# Altium project WS7.820.291.V04.PrjPCB
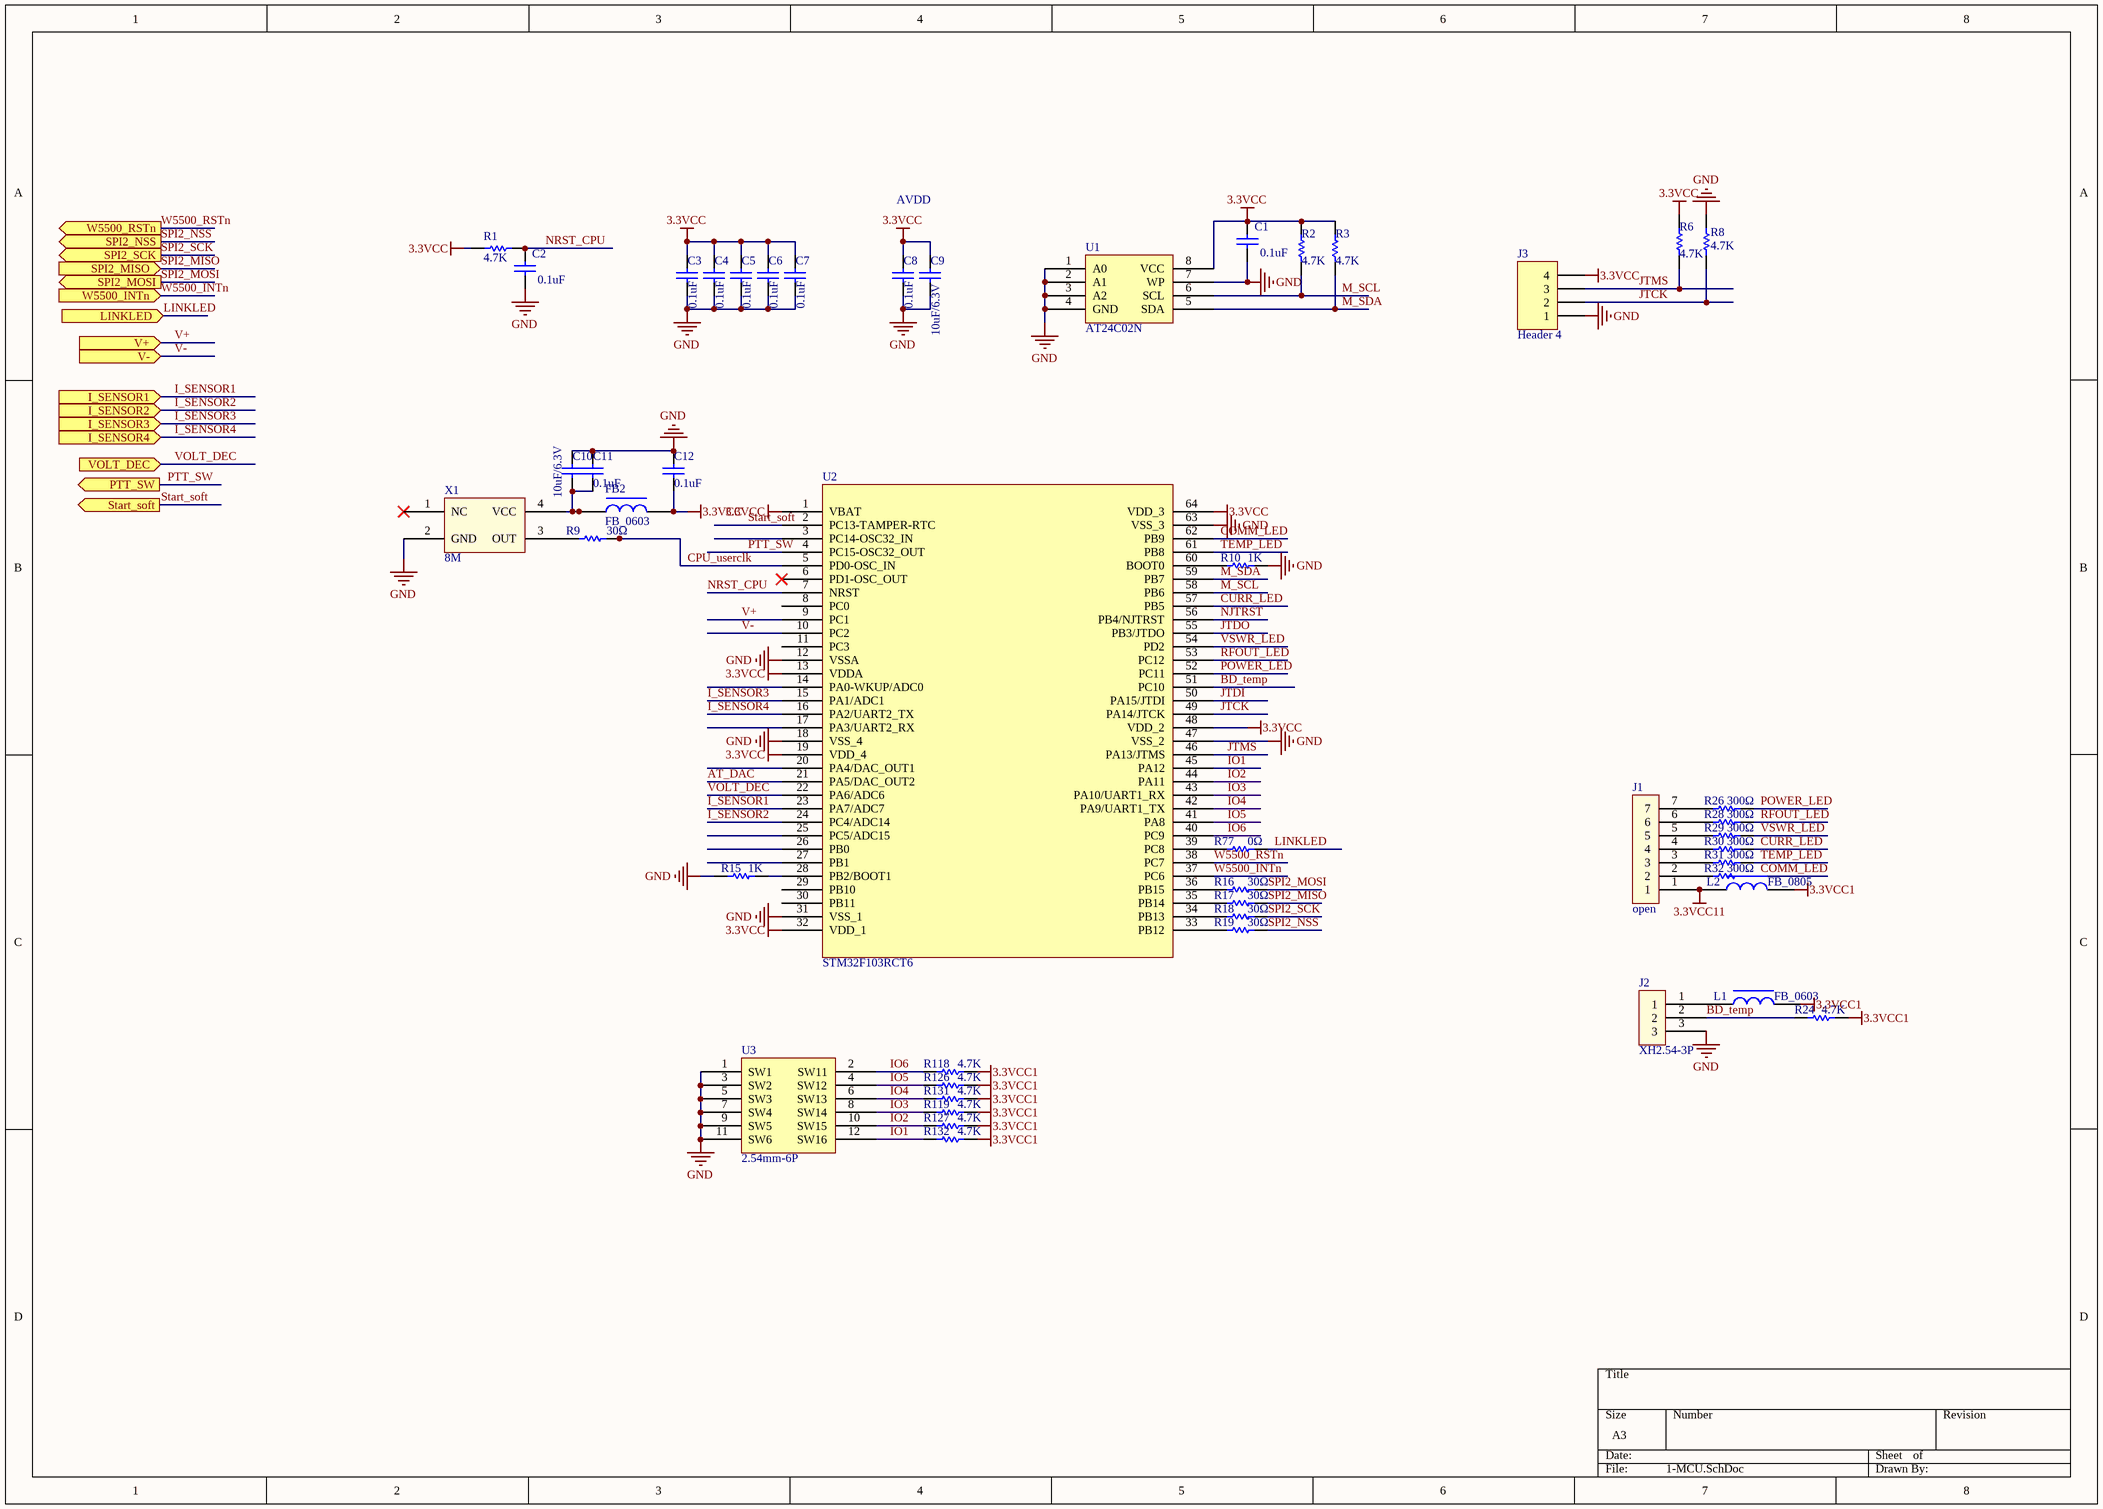
[diagram p0: 1-MCU.SchDoc]
4 sheets, 240 parts. Net scope: flat (ports and power ports of the same name join across sheets).
Board file: WS7.820.291.V04.PcbDoc
Sheets:
  1-MCU.SchDoc
  2-RJ45.SchDoc
  3-RF.SchDoc
  4-POWER.SchDoc

## Sheet 1-MCU.SchDoc
size A3

### Parts
C1  0.1uF  [C0603]
C2  0.1uF  [C0603]
C3  0.1uF  [C0603]
C4  0.1uF  [C0603]
C5  0.1uF  [C0603]
C6  0.1uF  [C0603]
C7  0.1uF  [C0603]
C8  0.1uF  [C0603]
C9  10uF/6.3V  [C0603]
C10  10uF/6.3V  [C0603]
C11  0.1uF  [C0603]
C12  0.1uF  [C0603]
FB2  FB_0603  [L0603]
J1  open  [KF2510-7P -2R54-17R8x6R0-wanzhen]
J2  XH2.54-3P  [XH2.54mm-10R0x7R0--zhizhen]
J3  Header 4  [HDR1X4]
L1  FB_0603  [L0603]
L2  FB_0805  [L0805]
R1  4.7K  [R0603]
R2  4.7K  [R0603]
R3  4.7K  [R0603]
R6  4.7K  [R0603]
R8  4.7K  [R0603]
R9  30Ω  [R0603]
R10  1K  [R0603]
R15  1K  [R0603]
R16  30Ω  [R0603]
R17  30Ω  [R0603]
R18  30Ω  [R0603]
R19  30Ω  [R0603]
R24  4.7K  [R0603]
R26  300Ω  [R0603]
R28  300Ω  [R0603]
R29  300Ω  [R0603]
R30  300Ω  [R0603]
R31  300Ω  [R0603]
R32  300Ω  [R0603]
R77  0Ω  [R0603]
R118  4.7K  [R0603]
R119  4.7K  [R0603]
R126  4.7K  [R0603]
R127  4.7K  [R0603]
R131  4.7K  [R0603]
R132  4.7K  [R0603]
U1  AT24C02N  [SOIC8_1R27_3R9x4R9]
U2  STM32F103RCT6  [LQFP64-0R50-10x10]
U3  2.54mm-6P  [con12TM-2R54-2X6-boma]
X1  8M  [CRY4SM-5R0x7R0]

### Ports
I_SENSOR1 (in), I_SENSOR2 (in), I_SENSOR3 (in), I_SENSOR4 (in), LINKLED (in), PTT_SW (out), SPI2_MISO (in), SPI2_MOSI (out), SPI2_NSS (out), SPI2_SCK (out), Start_soft (out), V+ (in), V- (in), VOLT_DEC (in), W5500_INTn (in), W5500_RSTn (out)

### Nets
3.3VCC: C1.2 C3.2 C4.2 C5.2 C6.2 C7.2 C8.2 C9.2 C12.1 FB2.2 J3.4 R1.2 R2.2 R3.2 R6.2 U1.8(VCC) U2.1(VBAT) U2.13(VDDA) U2.19(VDD_4) U2.32(VDD_1) U2.48(VDD_2) U2.64(VDD_3)
3.3VCC1: L1.2 L2.2 R24.1 R118.2 R119.2 R126.2 R127.2 R131.2 R132.2
3.3VCC11: J1.1 L2.1
GND: C1.1 C2.1 C3.1 C4.1 C5.1 C6.1 C7.1 C8.1 C9.1 C10.1 C11.2 C12.2 J2.3 J3.1 R8.1 R10.1 R15.1 U1.1(A0) U1.2(A1) U1.3(A2) U1.4(GND) U1.7(WP) U2.12(VSSA) U2.18(VSS_4) U2.31(VSS_1) U2.47(VSS_2) U2.63(VSS_3) U3.1(SW1) U3.3(SW2) U3.5(SW3) U3.7(SW4) U3.9(SW5) U3.11(SW6) X1.2(GND)
AT_DAC: U2.21(PA5/DAC_OUT2)
BD_temp: J2.2 R24.2 U2.51(PC10)
COMM_LED: R32.2 U2.62(PB9)
CPU_userclk: R9.2 U2.5(PD0-OSC_IN)
CURR_LED: R30.2 U2.57(PB5)
I_SENSOR1: U2.23(PA7/ADC7) ; port I_SENSOR1
I_SENSOR2: U2.24(PC4/ADC14) ; port I_SENSOR2
I_SENSOR3: U2.15(PA1/ADC1) ; port I_SENSOR3
I_SENSOR4: U2.16(PA2/UART2_TX) ; port I_SENSOR4
IO1: R132.1 U2.45(PA12) U3.12(SW16)
IO2: R127.1 U2.44(PA11) U3.10(SW15)
IO3: R119.1 U2.43(PA10/UART1_RX) U3.8(SW14)
IO4: R131.1 U2.42(PA9/UART1_TX) U3.6(SW13)
IO5: R126.1 U2.41(PA8) U3.4(SW12)
IO6: R118.1 U2.40(PC9) U3.2(SW11)
JTCK: J3.2 R8.2 U2.49(PA14/JTCK)
JTDI: U2.50(PA15/JTDI)
JTDO: U2.55(PB3/JTDO)
JTMS: J3.3 R6.1 U2.46(PA13/JTMS)
LINKLED: R77.2 ; port LINKLED
M_SCL: R2.1 U1.6(SCL) U2.58(PB6)
M_SDA: R3.1 U1.5(SDA) U2.59(PB7)
NJTRST: U2.56(PB4/NJTRST)
NRST_CPU: C2.2 R1.1 U2.7(NRST)
POWER_LED: R26.2 U2.52(PC11)
PTT_SW: U2.4(PC15-OSC32_OUT) ; port PTT_SW
RFOUT_LED: R28.2 U2.53(PC12)
SPI2_MISO: R17.2 ; port SPI2_MISO
SPI2_MOSI: R16.2 ; port SPI2_MOSI
SPI2_NSS: R19.2 ; port SPI2_NSS
SPI2_SCK: R18.2 ; port SPI2_SCK
Start_soft: U2.2(PC13-TAMPER-RTC) ; port Start_soft
TEMP_LED: R31.2 U2.61(PB8)
V+: U2.9(PC1) ; port V+
V-: U2.10(PC2) ; port V-
VOLT_DEC: U2.22(PA6/ADC6) ; port VOLT_DEC
VSWR_LED: R29.2 U2.54(PD2)
W5500_INTn: U2.37(PC6) ; port W5500_INTn
W5500_RSTn: U2.38(PC7) ; port W5500_RSTn
NetC10_2: C10.2 C11.1 FB2.1 X1.4(VCC)
NetJ1_2: J1.2 R32.1
NetJ1_3: J1.3 R31.1
NetJ1_4: J1.4 R30.1
NetJ1_5: J1.5 R29.1
NetJ1_6: J1.6 R28.1
NetJ1_7: J1.7 R26.1
NetJ2_1: J2.1 L1.1
NetR9_1: R9.1 X1.3(OUT)
NetR10_2: R10.2 U2.60(BOOT0)
NetR15_2: R15.2 U2.28(PB2/BOOT1)
NetR16_1: R16.1 U2.36(PB15)
NetR17_1: R17.1 U2.35(PB14)
NetR18_1: R18.1 U2.34(PB13)
NetR19_1: R19.1 U2.33(PB12)
NetR77_1: R77.1 U2.39(PC8)

Not connected (* = marked no-connect by the designer): U2 3(PC14-OSC32_IN) 6(PD1-OSC_OUT)* 8(PC0) 11(PC3) 14(PA0-WKUP/ADC0) 17(PA3/UART2_RX) 20(PA4/DAC_OUT1) 25(PC5/ADC15) 26(PB0) 27(PB1) 29(PB10) 30(PB11); X1 1(NC)*

### Notes on the sheet
- AVDD

### Library data of the parts
C1-C8 C11 C12 = 0.1uF贴片电容: 贴片电容_GRM188R71H104KA01D_0.1uF±10%,50V,0603; code: 01010045
C9 C10 = 10uF贴片电容: 贴片电容_GRM188R60J106ME47D_10uF±20%,6.3V,0603; code: 01010037
FB2 = 0603贴片磁珠: 贴片磁珠_100R,0603; code: 0103016
J1 = KF2510-7P连接器: 连接器_KF2510-7P_直插,间距2.54mm; code: 01090014
J2 = XH2.54-3P: 连接器_XH2.54-3P_弯针,间距2.54mm
J3 = Header 4: Header, 4-Pin; LatestRevisionDate: 17-Jul-2002; LatestRevisionNote: Re-released for DXP Platform.; Publisher: Altium Limited
L1 = 0805贴片磁珠: 贴片磁珠_600R,0805
L2 = 0805贴片磁珠: 贴片磁珠_600R,0805; code: 01030023
R1-R3 R6 R24 = 4.7K贴片电阻: 贴片电阻_4.7K±5%,0603; code: 01020012
R8 R10 R15 = 1K贴片电阻: 贴片电阻_1K±5%,0603; code: 01020082
R9 R16-R19 = 30Ω贴片电阻: 贴片电阻_30Ω±5%,0603; code: 01020108
R26 R28-R32 = 300Ω贴片电阻: 贴片电阻_300Ω±5%,0603; code: 01020008
R77 = 0Ω贴片电阻: 贴片电阻_0Ω±5%,0603; code: 01020010
R118 R119 R126 R127 R131 R132 = 1.5K贴片电阻: 贴片电阻_4.7K±5%,0603; code: 01020012
U1 = AT24C02N: EEPROM_AT24C02N_SOIC8; Maker: ATMEL; code: 01060068
U2 = STM32F103RCT6: MCU_STM32F103RCT6_32bit,LQFP64; code: 01060070; maker: ST
U3 = 拨码开关: 拨码开关_2.54mm-6P_侧拨
X1 = 16M贴片有源晶振: 贴片有源晶振_8M,20ppm,封装5x7

## Sheet 2-RJ45.SchDoc
size A3
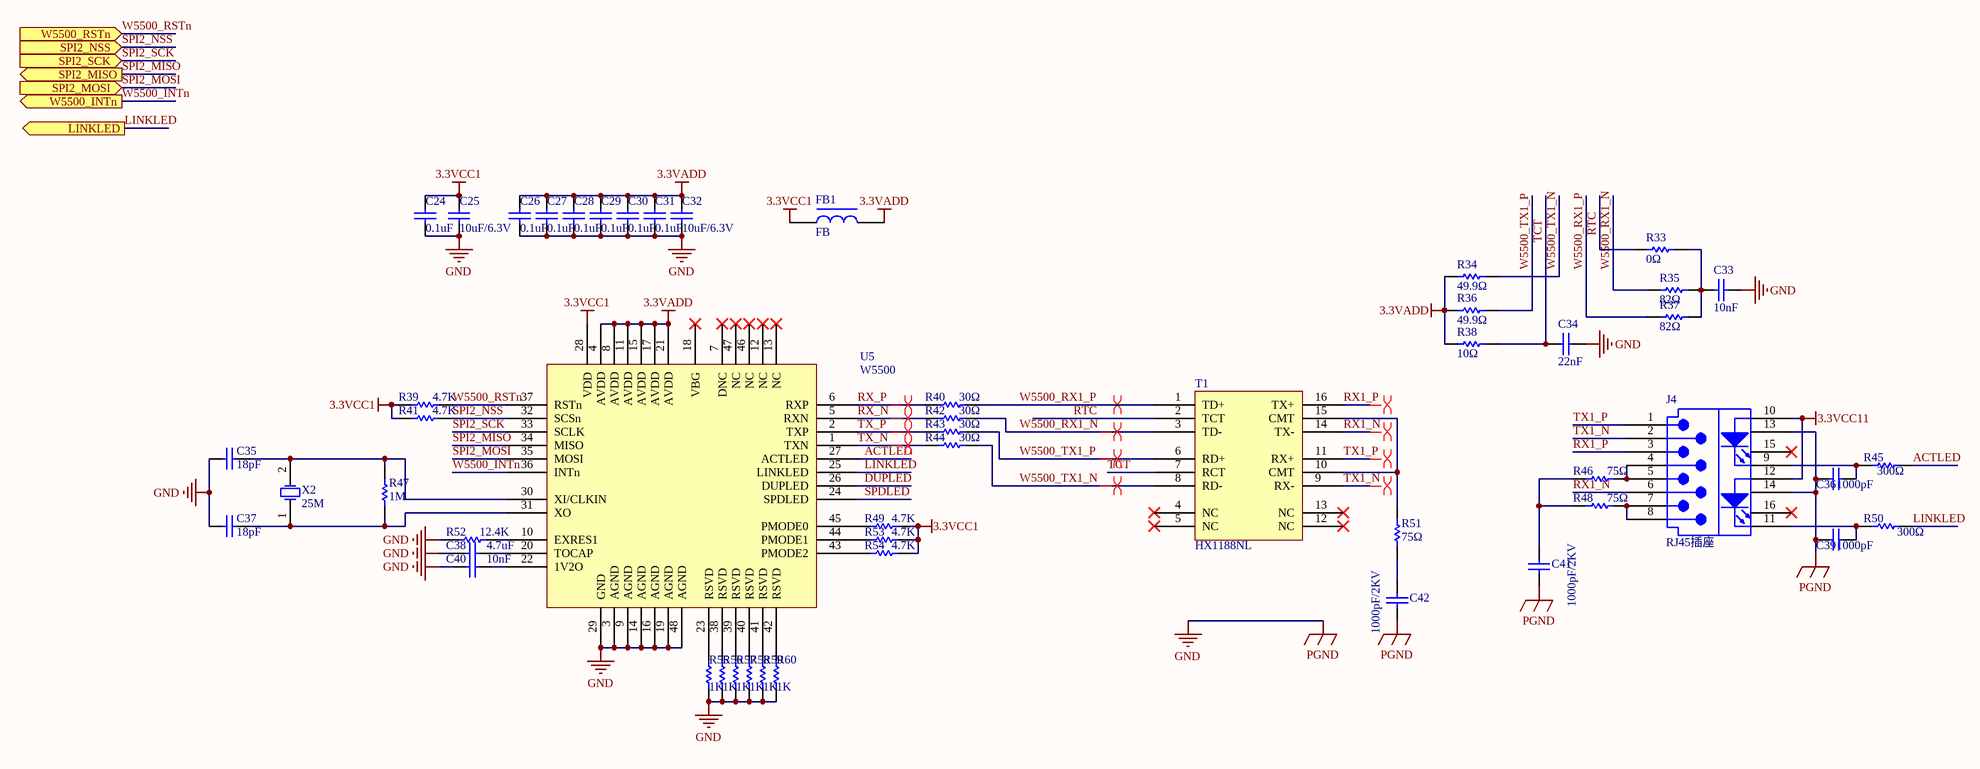
[diagram p1: 2-RJ45.SchDoc]

### Parts
C24  0.1uF  [C0603]
C25  10uF/6.3V  [C0603]
C26  0.1uF  [C0603]
C27  0.1uF  [C0603]
C28  0.1uF  [C0603]
C29  0.1uF  [C0603]
C30  0.1uF  [C0603]
C31  0.1uF  [C0603]
C32  10uF/6.3V  [C0603]
C33  10nF  [C0603]
C34  22nF  [C0603]
C35  18pF  [C0603]
C36  1000pF  [C0603]
C37  18pF  [C0603]
C38  4.7uF  [C0603]
C39  1000pF  [C0603]
C40  10nF  [C0603]
C41  1000pF/2KV  [C1206]
C42  1000pF/2KV  [C1206]
FB1  FB  [L0805]
J4  RJ45插座  [RJ45TH-1x1-2R54-LED]
R33  0Ω  [R0603]
R34  49.9Ω  [R0603]
R35  82Ω  [R0603]
R36  49.9Ω  [R0603]
R37  82Ω  [R0603]
R38  10Ω  [R0603]
R39  4.7K  [R0603]
R40  30Ω  [R0603]
R41  4.7K  [R0603]
R42  30Ω  [R0603]
R43  30Ω  [R0603]
R44  30Ω  [R0603]
R45  300Ω  [R0603]
R46  75Ω  [R0805]
R47  1M  [R0603]
R48  75Ω  [R0805]
R49  4.7K  [R0603]
R50  300Ω  [R0603]
R51  75Ω  [R1206]
R52  12.4K  [R0603]
R53  4.7K  [R0603]
R54  4.7K  [R0603]
R55  1K  [R0603]
R56  1K  [R0603]
R57  1K  [R0603]
R58  1K  [R0603]
R59  1K  [R0603]
R60  1K  [R0603]
T1  HX1188NL  [SOP16-1R27-7R11x12R7]
U5  W5500  [TQFN48-0R5-7X7]
X2  25M  [CRY2SM-6R0x3R5]

### Ports
LINKLED (out), SPI2_MISO (out), SPI2_MOSI (in), SPI2_NSS (in), SPI2_SCK (in), W5500_INTn (out), W5500_RSTn (in)

### Nets
3.3VADD: C26.2 C27.2 C28.2 C29.2 C30.2 C31.2 C32.2 FB1.2 R34.2 R36.2 R38.2 U5.4(AVDD) U5.8(AVDD) U5.11(AVDD) U5.15(AVDD) U5.17(AVDD) U5.21(AVDD)
3.3VCC1: C24.2 C25.2 FB1.1 R39.2 R41.2 R49.2 R53.2 R54.2 U5.28(VDD)
3.3VCC11: J4.10(A1) J4.12(A2)
GND: C24.1 C25.1 C26.1 C27.1 C28.1 C29.1 C30.1 C31.1 C32.1 C33.1 C34.1 C35.1 C36.1 C37.1 C38.1 C39.1 C40.1 C41.1 C42.1 J4.13 J4.14 R52.1 R55.1 R56.1 R57.1 R58.1 R59.1 R60.1 U5.3(AGND) U5.9(AGND) U5.14(AGND) U5.16(AGND) U5.19(AGND) U5.29(GND) U5.48(AGND)  [also labelled PGND]
ACTLED: R45.2 U5.27(ACTLED)
DUPLED: U5.26(DUPLED)
LINKLED: R50.2 U5.25(LINKLED) ; port LINKLED
RTC: R33.2 T1.2(TCT)
RX1_N: J4.6(RX-) T1.14(TX-)
RX1_P: J4.3(RX+) T1.16(TX+)
RX_N: R42.1 U5.5(RXN)
RX_P: R40.1 U5.6(RXP)
SPDLED: U5.24(SPDLED)
SPI2_MISO: U5.34(MISO) ; port SPI2_MISO
SPI2_MOSI: U5.35(MOSI) ; port SPI2_MOSI
SPI2_NSS: R41.1 U5.32(SCSn) ; port SPI2_NSS
SPI2_SCK: U5.33(SCLK) ; port SPI2_SCK
TCT: C34.2 R38.1 T1.7(RCT)
TX1_N: J4.2(TX-) T1.9(RX-)
TX1_P: J4.1(TX+) T1.11(RX+)
TX_N: R44.1 U5.1(TXN)
TX_P: R43.1 U5.2(TXP)
W5500_INTn: U5.36(INTn) ; port W5500_INTn
W5500_RSTn: R39.1 U5.37(RSTn) ; port W5500_RSTn
W5500_RX1_N: R35.2 R42.2 T1.3(TD-)
W5500_RX1_P: R37.2 R40.2 T1.1(TD+)
W5500_TX1_N: R34.1 R44.2 T1.8(RD-)
W5500_TX1_P: R36.1 R43.2 T1.6(RD+)
NetC33_2: C33.2 R33.1 R35.1 R37.1
NetC35_2: C35.2 R47.2 U5.30(XI/CLKIN) X2.2(OSC2)
NetC36_2: C36.2 J4.9(K1) R45.1
NetC37_2: C37.2 R47.1 U5.31(XO) X2.1(OSC1)
NetC38_2: C38.2 U5.20(TOCAP)
NetC39_2: C39.2 J4.11(K2) R50.1
NetC40_2: C40.2 U5.22(1V2O)
NetC41_2: C41.2 R46.1 R48.1
NetC42_2: C42.2 R51.1
NetJ4_4: J4.4(NC) J4.5(NC) R46.2
NetJ4_7: J4.7(NC) J4.8(NC) R48.2
NetR49_1: R49.1 U5.45(PMODE0)
NetR51_2: R51.2 T1.10(CMT) T1.15(CMT)
NetR52_2: R52.2 U5.10(EXRES1)
NetR53_1: R53.1 U5.44(PMODE1)
NetR54_1: R54.1 U5.43(PMODE2)
NetR55_2: R55.2 U5.23(RSVD)
NetR56_2: R56.2 U5.38(RSVD)
NetR57_2: R57.2 U5.39(RSVD)
NetR58_2: R58.2 U5.40(RSVD)
NetR59_2: R59.2 U5.41(RSVD)
NetR60_2: R60.2 U5.42(RSVD)

Not connected (* = marked no-connect by the designer): J4 15* 16*; T1 4(NC)* 5(NC)* 12(NC)* 13(NC)*; U5 7(DNC)* 12(NC)* 13(NC)* 18(VBG)* 46(NC)* 47(NC)*

### Layout directives
differential pair: RX1_N, RX1_P, RX_N, RX_P, TX1_N, TX1_P, TX_N, TX_P, W5500_RX1_N, W5500_RX1_P, W5500_TX1_N, W5500_TX1_P

### Library data of the parts
C24 C26-C31 = 0.1uF贴片电容: as C1 on sheet 1-MCU
C25 C32 = 10uF贴片电容: as C9 on sheet 1-MCU
C33 C40 = 0.1uF贴片电容: 贴片电容_10nF±10%,50V,0603
C34 = 27nF贴片电容: 贴片电容_22nF±5%,50V,0603; code: 01010054
C35 C37 = 20pF贴片电容: 贴片电容_18pF±5%,50V,0603
C36 C39 = 1000pF贴片电容: 贴片电容_GRM188R71H102KA01_1000pF±10%,50V,0603; code: 01010093
C38 = 1uF贴片电容: 贴片电容_4.7uF±10%,50V,0603
C41 C42 = 10uF贴片电容: 贴片电容_1000pF/2KV
FB1 = 0805贴片磁珠: 贴片磁珠_600R,0805; code: 01030023
J4 = RJ45弯脚带灯: RJ45插座_1*1,带左黄右绿灯,弯脚; MPN: 朱迅; code: 01090042
R33 = 0Ω贴片电阻: 贴片电阻_0Ω±5%,0603; code: 01020010
R34 R36 = 51Ω贴片电阻: 贴片电阻_49.9Ω±1%,0603; code: 01020126
R35 R37 = 51Ω贴片电阻: 贴片电阻_82Ω±1%,0603; code: 01020196
R38 = 10Ω贴片电阻: 贴片电阻_10Ω±5%,0603; code: 01020104
R39 R41 R49 R53 R54 = 4.7K贴片电阻: 贴片电阻_4.7K±5%,0603; code: 01020012
R40 R42-R44 = 30Ω贴片电阻: 贴片电阻_30Ω±5%,0603; code: 01020108
R45 R50 = 300Ω贴片电阻: 贴片电阻_300Ω±5%,0603; code: 01020008
R46 R48 = 75Ω贴片电阻: 贴片电阻_75Ω±5%,0805; code: 01020068
R47 = 1M贴片电阻: 贴片电阻_1M±5%,0603; code: 01020093
R51 = 75Ω贴片电阻: 贴片电阻_75Ω±5%,1206; code: 01020197
R52 = 12K贴片电阻: 贴片电阻_12.4K±1%,0603
R55-R60 = 1K贴片电阻: 贴片电阻_1K±5%,0603; code: 01020082
T1 = HX1188NL: 网络变压器_HX1188NL_百兆,SOIC16; code: 01060114
U5 = W5500: 以太网控制器_W5500_LQFP48; code: 01060113
X2 = 25M贴片无源晶体: 贴片无源晶体_25MHz,30ppm,6035封装; code: 03050012

## Sheet 3-RF.SchDoc
size A3
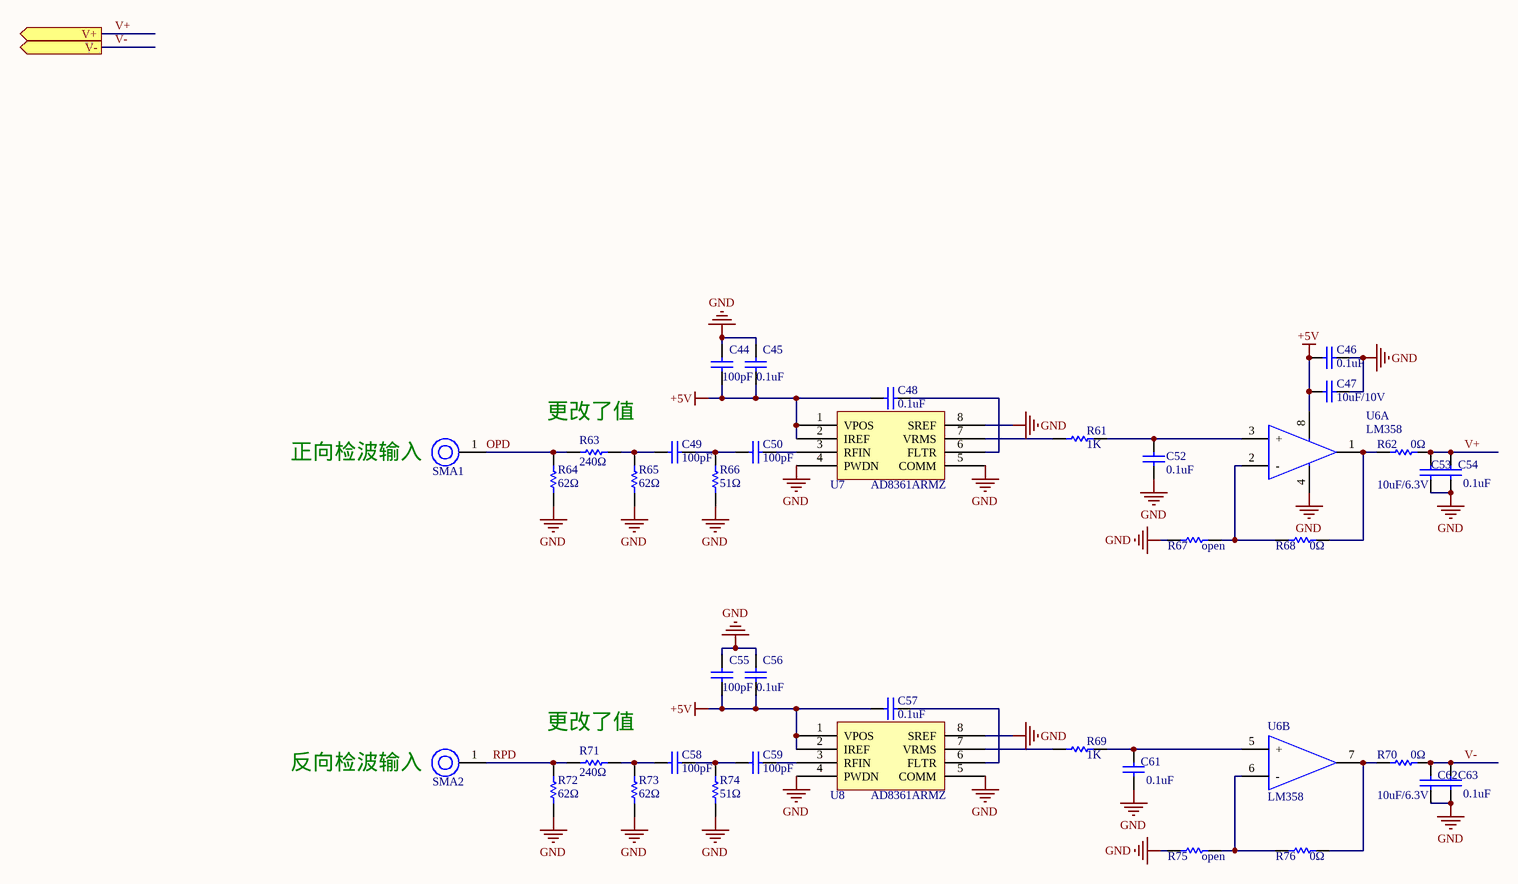
[diagram p2: 3-RF.SchDoc]

### Parts
C44  100pF  [C0603]
C45  0.1uF  [C0603]
C46  0.1uF  [C0603]
C47  10uF/10V  [C0805]
C48  0.1uF  [C0603]
C49  100pF  [C0805]
C50  100pF  [C0805]
C52  0.1uF  [C0603]
C53  10uF/6.3V  [C0603]
C54  0.1uF  [C0603]
C55  100pF  [C0603]
C56  0.1uF  [C0603]
C57  0.1uF  [C0603]
C58  100pF  [C0805]
C59  100pF  [C0805]
C61  0.1uF  [C0603]
C62  10uF/6.3V  [C0603]
C63  0.1uF  [C0603]
R61  1K  [R0603]
R62  0Ω  [R0603]
R63  240Ω  [R0805]
R64  62Ω  [R0805]
R65  62Ω  [R0805]
R66  51Ω  [R0805]
R67  open  [R0603]
R68  0Ω  [R0603]
R69  1K  [R0603]
R70  0Ω  [R0603]
R71  240Ω  [R0805]
R72  62Ω  [R0805]
R73  62Ω  [R0805]
R74  51Ω  [R0805]
R75  open  [R0603]
R76  0Ω  [R0603]
SMA1  SMA-50KFD-4  [SMA-50KFD-4]  (value not drawn)
SMA2  SMA-50KFD-4  [SMA-50KFD-4]  (value not drawn)
U6  LM358  [SOIC8_1R27_3R9x4R9]  (parts A,B of 2)
U7  AD8361ARMZ  [micro_SOIC8-0R65-3x3]
U8  AD8361ARMZ  [micro_SOIC8-0R65-3x3]

### Ports
V+ (out), V- (out)

### Nets
+5V: C44.1 C45.1 C46.1 C47.1 C48.2 C55.1 C56.1 C57.2 U6.8 U7.1(VPOS) U7.2(IREF) U8.1(VPOS) U8.2(IREF)
GND: C44.2 C45.2 C46.2 C47.2 C52.1 C53.1 C54.1 C55.2 C56.2 C61.1 C62.1 C63.1 R64.1 R65.1 R66.1 R67.1 R72.1 R73.1 R74.1 R75.1 U6.4 U7.4(PWDN) U7.5(COMM) U7.8(SREF) U8.4(PWDN) U8.5(COMM) U8.8(SREF)
OPD: R63.1 R64.2 SMA1.1(Sig)
RPD: R71.1 R72.2 SMA2.1(Sig)
V+: C53.2 C54.2 R62.2 ; port V+
V-: C62.2 C63.2 R70.2 ; port V-
NetC48_1: C48.1 U7.6(FLTR)
NetC49_1: C49.1 R63.2 R65.2
NetC49_2: C49.2 C50.1 R66.2
NetC50_2: C50.2 U7.3(RFIN)
NetC52_2: C52.2 R61.2 U6.3(+)
NetC57_1: C57.1 U8.6(FLTR)
NetC58_1: C58.1 R71.2 R73.2
NetC58_2: C58.2 C59.1 R74.2
NetC59_2: C59.2 U8.3(RFIN)
NetC61_2: C61.2 R69.2 U6.5(+)
NetR61_1: R61.1 U7.7(VRMS)
NetR62_1: R62.1 R68.2 U6.1
NetR67_2: R67.2 R68.1 U6.2(-)
NetR69_1: R69.1 U8.7(VRMS)
NetR70_1: R70.1 R76.2 U6.7
NetR75_2: R75.2 R76.1 U6.6(-)

### Notes on the sheet
- 更改了值
- 正向检波输入
- 反向检波输入

### Library data of the parts
C44 C55 = 220pF贴片电容: 贴片电容_100pF±10%,50V,0603
C45 C46 C48 C52 C54 C56 C57 C61 C63 = 0.1uF贴片电容: as C1 on sheet 1-MCU
C47 = 10uF贴片电容: 贴片电容_GRM21BR61A106KE19L_10uF±10%,10V,0805; code: 01010036
C49 C50 C58 C59 = 100pF贴片电容: 贴片电容_GRM2165C1H101JA01D_100pF±5%,50V,0805; code: 01010043
C53 C62 = 10uF贴片电容: as C9 on sheet 1-MCU
R61 R69 = 1K贴片电阻: 贴片电阻_1K±5%,0603; code: 01020082
R62 R68 R70 R76 = 0Ω贴片电阻: 贴片电阻_0Ω±5%,0603; code: 01020010
R63 R71 = 300Ω贴片电阻: 贴片电阻_300Ω±5%,0805; code: 01020037
R64 R65 R72 R73 = 62Ω贴片电阻: 贴片电阻_62Ω±5%,0805; code: 01020035
R66 R74 = 51Ω贴片电阻: 贴片电阻_51Ω±5%,0805; code: 01020023
R67 R75 = 0Ω贴片电阻
SMA1 SMA2 = SMA-50KFD-4: 射频同轴连接器_SMA-50KFD-4; code: 03100009
U6 = LM358: 运算放大器_LM358_SOIC8; Maker: MOTOROLA; code: 01060025
U7 U8 = AD8361ARMZ: 检波器_AD8361ARMZ_LF to 2.5 GHz,SOIC8; Maker: ADI; code: 01060004

## Sheet 4-POWER.SchDoc
size A3
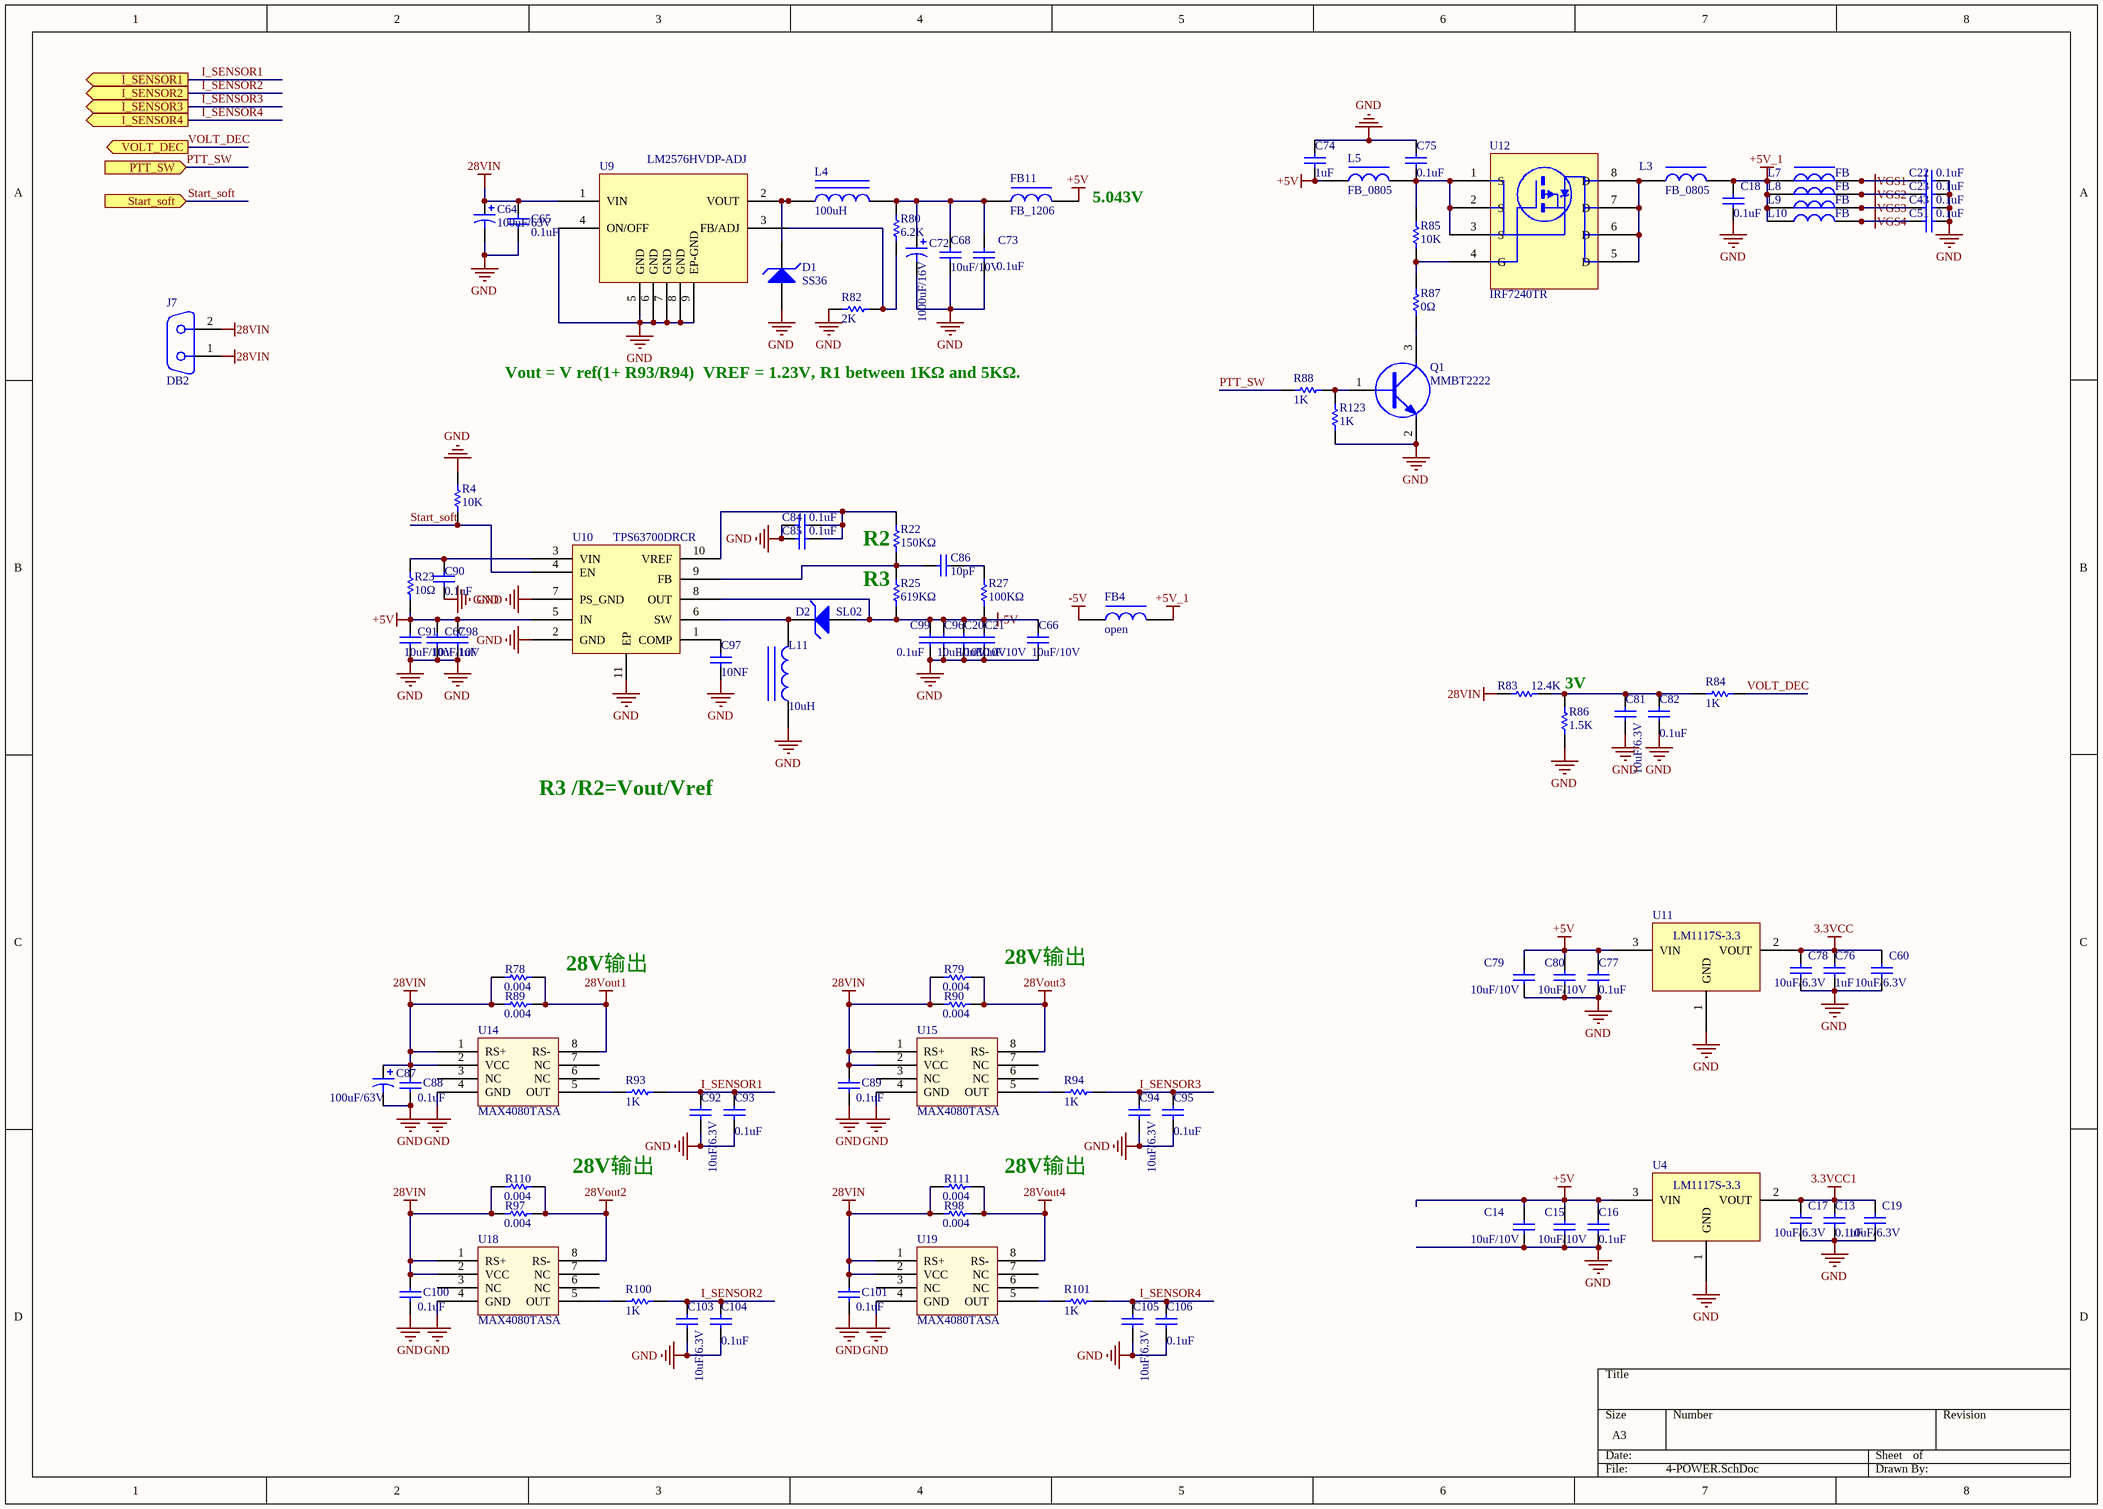
[diagram p3: 4-POWER.SchDoc]

### Parts
C13  0.1uF  [C0603]
C14  10uF/10V  [C0805]
C15  10uF/10V  [C0805]
C16  0.1uF  [C0603]
C17  10uF/6.3V  [C0603]
C18  0.1uF  [C0603]
C19  10uF/6.3V  [C0603]
C20  10uF/10V  [C0805]
C21  10uF/10V  [C0805]
C22  0.1uF  [C0603]
C23  0.1uF  [C0603]
C43  0.1uF  [C0603]
C51  0.1uF  [C0603]
C60  10uF/6.3V  [C0603]
C64  100uF/63V  [ECAP2SM_10R4x10R4]
C65  0.1uF  [C0603]
C66  10uF/10V  [C0805]
C67  10uF/10V  [C0805]
C68  10uF/10V  [C0805]
C72  1000uF/16V  [ECAP2SM_10R4x10R4]
C73  0.1uF  [C0603]
C74  1uF  [C0603]
C75  0.1uF  [C0603]
C76  1uF  [C0603]
C77  0.1uF  [C0603]
C78  10uF/6.3V  [C0603]
C79  10uF/10V  [C0805]
C80  10uF/10V  [C0805]
C81  10uF/6.3V  [C0603]
C82  0.1uF  [C0603]
C84  0.1uF  [C0603]
C85  0.1uF  [C0603]
C86  10pF  [C0603]
C87  100uF/63V  [ECAP2SM_10R4x10R4]
C88  0.1uF  [C0603]
C89  0.1uF  [C0603]
C90  0.1uF  [C0603]
C91  10uF/10V  [C0805]
C92  10uF/6.3V  [C0603]
C93  0.1uF  [C0603]
C94  10uF/6.3V  [C0603]
C95  0.1uF  [C0603]
C96  10uF/10V  [C0805]
C97  10NF  [C0603]
C98  1uF  [C0603]
C99  0.1uF  [C0603]
C100  0.1uF  [C0603]
C101  0.1uF  [C0603]
C103  10uF/6.3V  [C0603]
C104  0.1uF  [C0603]
C105  10uF/6.3V  [C0603]
C106  0.1uF  [C0603]
D1  SS36  [DO-214AC]
D2  SL02  [SL02]
FB4  open  [L0805]
FB11  FB_1206  [L1206]
J7  DB2  [DB2TM-VM]
L3  FB_0805  [L0805]
L4  100uH  [PL2SM-12R5x12R5]
L5  FB_0805  [L0805]
L7  FB  [L0805]
L8  FB  [L0805]
L9  FB  [L0805]
L10  FB  [L0805]
L11  10uH  [PL2SM-3R0x3R0]
Q1  MMBT2222  [SOT23-3]
R4  10K  [R0603]
R22  150KΩ  [R0603]
R23  10Ω  [R0603]
R25  619KΩ  [R0603]
R27  100KΩ  [R0603]
R78  0.004  [R2512]
R79  0.004  [R2512]
R80  6.2K  [R0603]
R82  2K  [R0603]
R83  12.4K  [R0603]
R84  1K  [C0603]
R85  10K  [R0603]
R86  1.5K  [R0603]
R87  0Ω  [R0603]
R88  1K  [R0603]
R89  0.004  [R2512]
R90  0.004  [R2512]
R93  1K  [R0603]
R94  1K  [R0603]
R97  0.004  [R2512]
R98  0.004  [R2512]
R100  1K  [R0603]
R101  1K  [R0603]
R110  0.004  [R2512]
R111  0.004  [R2512]
R123  1K  [R0603]
U4  LM1117S-3.3  [SOT-223]
U9  LM2576HVDP-ADJ  [SOIC8_1R27_3R9x4R9-1]
U10  TPS63700DRCR  [VSON10-0R5-3x3]
U11  LM1117S-3.3  [SOT-223]
U12  IRF7240TR  [SOIC8_1R27_3R9x4R9]
U14  MAX4080TASA  [SOIC8_1R27_3R9x4R9]
U15  MAX4080TASA  [SOIC8_1R27_3R9x4R9]
U18  MAX4080TASA  [SOIC8_1R27_3R9x4R9]
U19  MAX4080TASA  [SOIC8_1R27_3R9x4R9]

### Ports
I_SENSOR1 (out), I_SENSOR2 (out), I_SENSOR3 (out), I_SENSOR4 (out), PTT_SW (in), Start_soft (in), VOLT_DEC (out)

### Nets
3.3VCC: C60.2 C76.2 C78.2 U11.2(VOUT)
3.3VCC1: C13.2 C17.2 C19.2 U4.2(VOUT)
28VIN: C64.1 C65.2 C87.1 C88.2 C89.2 C100.2 C101.2 J7.1 J7.2 R78.1 R79.1 R83.1 R89.1 R90.1 R97.1 R98.1 R110.1 R111.1 U9.1(VIN) U14.1(RS+) U14.2(VCC) U15.1(RS+) U15.2(VCC) U18.1(RS+) U18.2(VCC) U19.1(RS+) U19.2(VCC)
28Vout1: R78.2 R89.2 U14.8(RS-)
28Vout2: R97.2 R110.2 U18.8(RS-)
28Vout3: R79.2 R90.2 U15.8(RS-)
28Vout4: R98.2 R111.2 U19.8(RS-)
+5V: C14.2 C15.2 C16.2 C67.2 C74.1 C77.2 C79.2 C80.2 C91.2 C98.2 FB11.2 L5.1 R23.1 U4.3(VIN) U10.5(IN) U11.3(VIN)
+5V_1: C18.2 FB4.2 L3.2 L7.1 L8.1 L9.1 L10.1
-5V: C20.2 C21.2 C66.2 C96.2 C99.2 D2.1(A) FB4.1 R25.1 R27.1 U10.8(OUT)
GND: C13.1 C14.1 C15.1 C16.1 C17.1 C18.1 C19.1 C20.1 C21.1 C22.2 C23.2 C43.2 C51.2 C60.1 C64.2 C65.1 C66.1 C67.1 C68.1 C72.2 C73.1 C74.2 C75.2 C76.1 C77.1 C78.1 C79.1 C80.1 C81.1 C82.1 C84.2 C85.2 C87.2 C88.1 C89.1 C90.1 C91.1 C92.1 C93.1 C94.1 C95.1 C96.1 C97.1 C98.1 C99.1 C100.1 C101.1 C103.1 C104.1 C105.1 C106.1 D1.1(A) L11.1 Q1.2(E) R4.2 R82.2 R86.1 R123.1 U4.1(GND) U9.4(ON/OFF) U9.5(GND) U9.6(GND) U9.7(GND) U9.8(GND) U9.9(EP-GND) U10.2(GND) U10.7(PS_GND) U10.11(EP) U11.1(GND) U14.4(GND) U15.4(GND) U18.4(GND) U19.4(GND)
VGS1: C22.1 L7.2
VGS2: C23.1 L8.2
VGS3: C43.1 L9.2
VGS4: C51.1 L10.2
I_SENSOR1: C92.2 C93.2 R93.2 ; port I_SENSOR1
I_SENSOR2: C103.2 C104.2 R100.2 ; port I_SENSOR2
I_SENSOR3: C94.2 C95.2 R94.2 ; port I_SENSOR3
I_SENSOR4: C105.2 C106.2 R101.2 ; port I_SENSOR4
PTT_SW: R88.1 ; port PTT_SW
Start_soft: R4.1 U10.4(EN) ; port Start_soft
VOLT_DEC: R84.1 ; port VOLT_DEC
NetC68_2: C68.2 C72.1 C73.2 FB11.1 L4.2 R80.2
NetC75_1: C75.1 L5.2 R85.2 U12.1(S) U12.2(S) U12.3(S)
NetC81_2: C81.2 C82.2 R83.2 R84.2 R86.2
NetC84_1: C84.1 C85.1 R22.2 U10.10(VREF)
NetC86_1: C86.1 R22.1 R25.2 U10.9(FB)
NetC86_2: C86.2 R27.2
NetC90_2: C90.2 R23.2 U10.3(VIN)
NetC97_2: C97.2 U10.1(COMP)
NetD1_2: D1.2(K) L4.1 U9.2(VOUT)
NetD2_2: D2.2(K) L11.2 U10.6(SW)
NetL3_1: L3.1 U12.5(D) U12.6(D) U12.7(D) U12.8(D)
NetQ1_1: Q1.1(B) R88.2 R123.2
NetQ1_3: Q1.3(C) R87.1
NetR80_1: R80.1 R82.1 U9.3(FB/ADJ)
NetR85_1: R85.1 R87.2 U12.4(G)
NetR93_1: R93.1 U14.5(OUT)
NetR94_1: R94.1 U15.5(OUT)
NetR100_1: R100.1 U18.5(OUT)
NetR101_1: R101.1 U19.5(OUT)

Not connected (* = marked no-connect by the designer): U14 3(NC) 6(NC) 7(NC); U15 3(NC) 6(NC) 7(NC); U18 3(NC) 6(NC) 7(NC); U19 3(NC) 6(NC) 7(NC)

### Notes on the sheet
- (near FB11) 5.043V
- Vout = V ref(1+ R93/R94)  VREF = 1.23V, R1 between 1KΩ and 5KΩ.
- R3
- (near R22) R2
- (near R86) 3V
- R3 /R2=Vout/Vref
- 28V输出

### Library data of the parts
C13 C74 C76 = 1uF贴片电容: 贴片电容_GRM188R61A105KA61D_1uF±10%,10V,0603; code: 01010038
C14 C15 C20 C21 C66-C68 C79 C80 C91 C96 = 10uF贴片电容: as C47 on sheet 3-RF
C16 C65 C73 C75 C77 C82 C88 C89 C93 C95 C100 C101 C104 C106 = 0.1uF贴片电容: as C1 on sheet 1-MCU
C17 C19 C60 C78 C81 C92 C94 C103 C105 = 10uF贴片电容: as C9 on sheet 1-MCU
C18 C22 C23 C43 C51 C84 C85 C90 C99 = 0.1uF: GRM188R71H104KA01D; MPN: MURATA; WSPN: 01010045
C64 C87 = 100uF/63V: 贴片电解电容_VEJ101M1JTR-1010_100uF/63V,±20%,表贴D10*H10; code: 01080002
C72 = 1000uF/16V: 贴片电解电容_VE102M1CTR-1010_1000uF/16V,±20%,表贴10*10; code: 01080003
C86 = 10pF贴片电容: 贴片电容_0603CG100J500NT_10pF±5%,50V,0603; code: 01010001
C97 = 0.1uF: 0603,10NF,50V,±10％,X7R
C98 = 0.1uF
D1 = 肖特基整流二极管_SS36: 肖特基整流二极管_SS36_封装SMA,3A/60V; code: 01040003
D2 = 肖特基整流二极管_SS36: 肖特基整流二极管_SL02_1.1A/20V
FB4 L3 L5 L7-L10 = 0805贴片磁珠: 贴片磁珠_600R,0805; code: 01030023
FB11 = 1206贴片磁珠: 贴片磁珠_30R,6A,1206; code: 0103015
J7 = DB2公头座子: 连接器_DB2公头,电源接头; code: 0207001
L4 = 100uH贴片功率电感: 贴片功率电感_SLF12575T-101M1R9-PF_100uH±20%,额定电流1.9A,12.5x12.5; code: 01030003
L11 = SLF6025T-100M1R0-PF: SLF6025-10uH
Q1 = MMBT2222: NPN三极管_MMBT2222_表贴SOT23; code: 01050001
R4 R85 = 10K贴片电阻: 贴片电阻_10K±5%,0603; code: 01020011
R22 R25 R27 = 10Ω贴片电阻
R23 = 10Ω贴片电阻: 贴片电阻_10Ω±5%,0603; code: 01020104
R78 R79 R89 R90 R97 R98 R110 R111 = 0.004Ω检流电阻-大封装: 贴片电阻_LR12DTDSR004_0.004±5%,2W,2512; code: 01020105
R80 = 6.2K贴片电阻: 贴片电阻_6.2K±5%,0603; code: 01020106
R82 = 2K贴片电阻: 贴片电阻_2K±5%,0603; code: 01020086
R83 = 12.4K贴片电阻: 贴片电阻_12.4K±1%,0603; code: 01020125
R84 R88 R93 R94 R100 R101 R123 = 1K贴片电阻: 贴片电阻_1K±5%,0603; code: 01020082
R86 = 1.5K贴片电阻: 贴片电阻_1.5K±5%,0603; code: 01020063
R87 = 0Ω贴片电阻: 贴片电阻_0Ω±5%,0603; code: 01020010
U4 U11 = LM1117S-3.3: LDO_LM1117S-3.3_1A输出,SOT223; code: 01060031
U9 = LM2576HVDP-ADJ: 稳压集成电路_LM2576HVDP-ADJ_3A输出,SOIC8; code: 03020005; Maker: HTC
U10 = TPS63700DRCR: 负压转换器_TPS63700DRCR_360mA输出,VSON-10; Maker: TI
U12 = IRF7240TR: P-MOSFET_IRF7240TR_SOIC8; Maker: IR; code: 01050003
U14 U15 U18 U19 = MAX4080TASA: 电流检测放大器_MAX4080TASA_SOIC8; Maker: MAXIM; code: 01060003

## Nets that join several sheets
3.3VCC: 1-MCU (22 pins), 4-POWER (C60.2 C76.2 C78.2 U11.2)
3.3VCC1: 1-MCU (9 pins), 2-RJ45 (9 pins), 4-POWER (C13.2 C17.2 C19.2 U4.2)
3.3VCC11: 1-MCU (J1.1 L2.1), 2-RJ45 (J4.10 J4.12)
+5V: 3-RF (13 pins), 4-POWER (16 pins)
GND: 1-MCU (34 pins), 2-RJ45 (35 pins), 3-RF (27 pins), 4-POWER (73 pins)
I_SENSOR1: 1-MCU (U2.23), 4-POWER (C92.2 C93.2 R93.2)
I_SENSOR2: 1-MCU (U2.24), 4-POWER (C103.2 C104.2 R100.2)
I_SENSOR3: 1-MCU (U2.15), 4-POWER (C94.2 C95.2 R94.2)
I_SENSOR4: 1-MCU (U2.16), 4-POWER (C105.2 C106.2 R101.2)
LINKLED: 1-MCU (R77.2), 2-RJ45 (R50.2 U5.25)
PTT_SW: 1-MCU (U2.4), 4-POWER (R88.1)
SPI2_MISO: 1-MCU (R17.2), 2-RJ45 (U5.34)
SPI2_MOSI: 1-MCU (R16.2), 2-RJ45 (U5.35)
SPI2_NSS: 1-MCU (R19.2), 2-RJ45 (R41.1 U5.32)
SPI2_SCK: 1-MCU (R18.2), 2-RJ45 (U5.33)
Start_soft: 1-MCU (U2.2), 4-POWER (R4.1 U10.4)
V+: 1-MCU (U2.9), 3-RF (C53.2 C54.2 R62.2)
V-: 1-MCU (U2.10), 3-RF (C62.2 C63.2 R70.2)
VOLT_DEC: 1-MCU (U2.22), 4-POWER (R84.1)
W5500_INTn: 1-MCU (U2.37), 2-RJ45 (U5.36)
W5500_RSTn: 1-MCU (U2.38), 2-RJ45 (R39.1 U5.37)